# Altium schematic sheet CC-S02-V00-HighSideOutputs.SchDoc: High Side Outputs (BTS7080-2EPA)
size A3; DrawnBy: Jonn Dillon; DocumentNumber: 3; SheetNumber: 3; SheetTotal: 13; Project: Chassis Controller (Interim) 2020
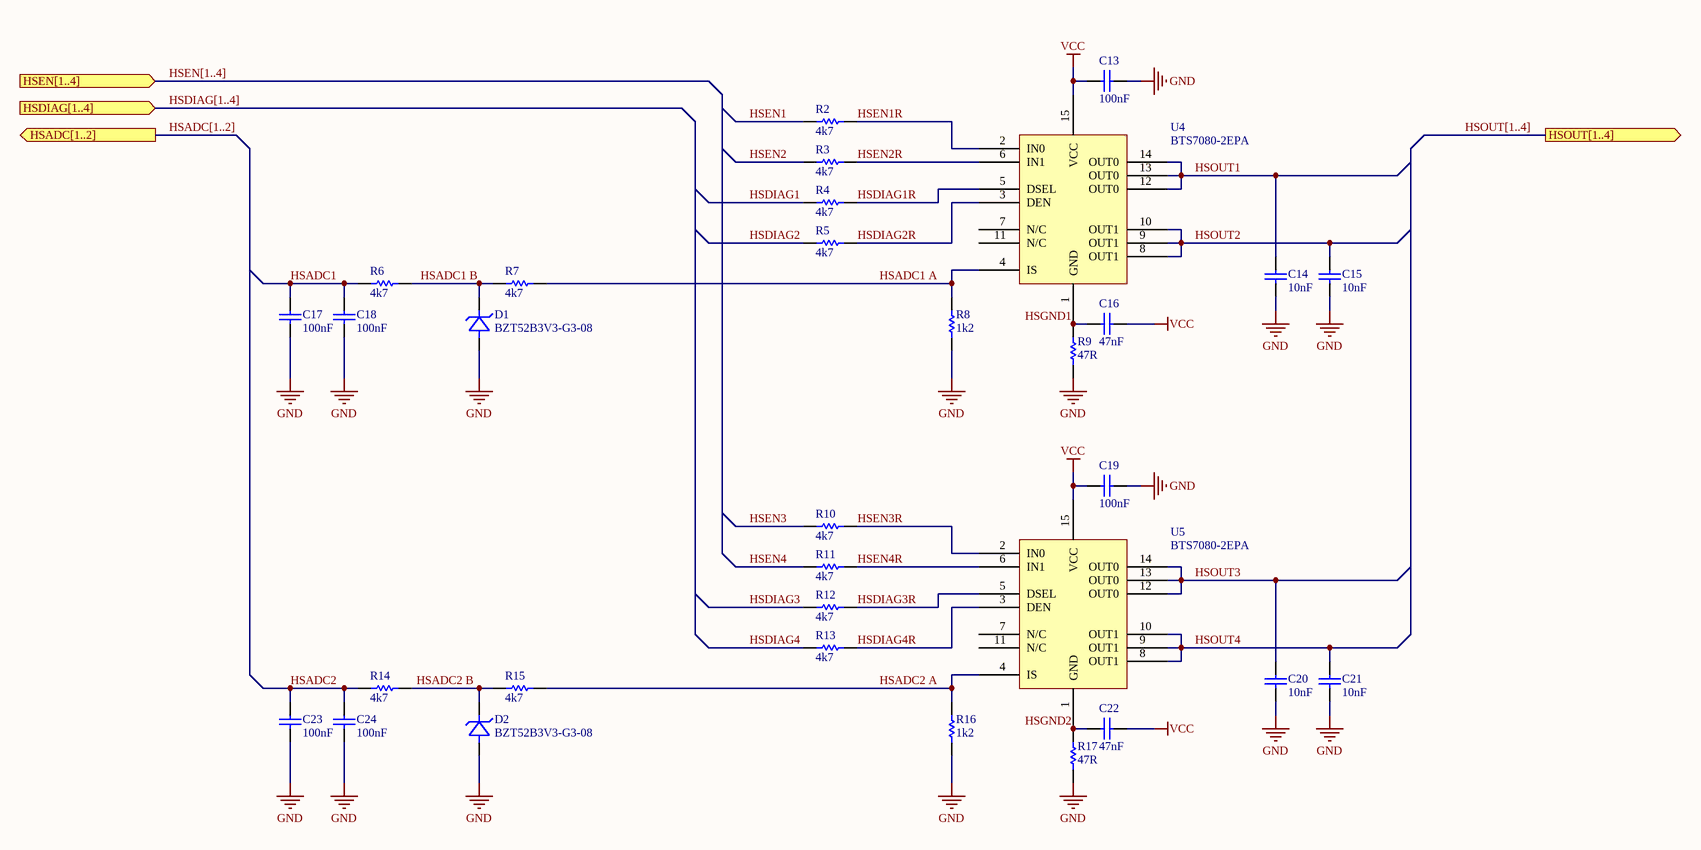
[diagram p0: CC-S02-V00-HighSideOutputs.SchDoc]

## Parts
C13  100nF  [Cap_Ceramic_0603]
C14  10nF  [Cap_Ceramic_0603]
C15  10nF  [Cap_Ceramic_0603]
C16  47nF  [Cap_Ceramic_0603]
C17  100nF  [Cap_Ceramic_0603]
C18  100nF  [Cap_Ceramic_0603]
C19  100nF  [Cap_Ceramic_0603]
C20  10nF  [Cap_Ceramic_0603]
C21  10nF  [Cap_Ceramic_0603]
C22  47nF  [Cap_Ceramic_0603]
C23  100nF  [Cap_Ceramic_0603]
C24  100nF  [Cap_Ceramic_0603]
D1  BZT52B3V3-G3-08  [SOD123]
D2  BZT52B3V3-G3-08  [SOD123]
R2  4k7  [Res_ThinFilm_0603]
R3  4k7  [Res_ThinFilm_0603]
R4  4k7  [Res_ThinFilm_0603]
R5  4k7  [Res_ThinFilm_0603]
R6  4k7  [Res_ThinFilm_0603]
R7  4k7  [Res_ThinFilm_0603]
R8  1k2  [Res_ThinFilm_0603]
R9  47R  [Res_ThinFilm_0603]
R10  4k7  [Res_ThinFilm_0603]
R11  4k7  [Res_ThinFilm_0603]
R12  4k7  [Res_ThinFilm_0603]
R13  4k7  [Res_ThinFilm_0603]
R14  4k7  [Res_ThinFilm_0603]
R15  4k7  [Res_ThinFilm_0603]
R16  1k2  [Res_ThinFilm_0603]
R17  47R  [Res_ThinFilm_0603]
U4  BTS7080-2EPA  [BTS70802EPA]
U5  BTS7080-2EPA  [BTS70802EPA]

## Ports
HSADC[1..2] (out), HSDIAG[1..4] (in), HSEN[1..4] (in), HSOUT[1..4] (out)

## Nets
GND: C13.2 C14.1 C15.1 C17.1 C18.1 C19.2 C20.1 C21.1 C23.1 C24.1 D1.A(Anode) D2.A(Anode) R8.2 R9.1 R16.2 R17.1
VCC: C13.1 C16.2 C19.1 C22.2 U4.15(VCC) U5.15(VCC)
HSADC1: C17.2 C18.2 R6.1
HSADC1 A: R7.2 R8.1 U4.4(IS)
HSADC1 B: D1.K(Cathode) R6.2 R7.1
HSADC2: C23.2 C24.2 R14.1
HSADC2 A: R15.2 R16.1 U5.4(IS)
HSADC2 B: D2.K(Cathode) R14.2 R15.1
HSDIAG1: R4.1
HSDIAG1R: R4.2 U4.5(DSEL)
HSDIAG2: R5.1
HSDIAG2R: R5.2 U4.3(DEN)
HSDIAG3: R12.1
HSDIAG3R: R12.2 U5.5(DSEL)
HSDIAG4: R13.1
HSDIAG4R: R13.2 U5.3(DEN)
HSEN1: R2.1
HSEN1R: R2.2 U4.2(IN0)
HSEN2: R3.1
HSEN2R: R3.2 U4.6(IN1)
HSEN3: R10.1
HSEN3R: R10.2 U5.2(IN0)
HSEN4: R11.1
HSEN4R: R11.2 U5.6(IN1)
HSGND1: C16.1 R9.2 U4.1(GND)
HSGND2: C22.1 R17.2 U5.1(GND)
HSOUT1: C14.2 U4.12(OUT0) U4.13(OUT0) U4.14(OUT0)
HSOUT2: C15.2 U4.8(OUT1) U4.9(OUT1) U4.10(OUT1)
HSOUT3: C20.2 U5.12(OUT0) U5.13(OUT0) U5.14(OUT0)
HSOUT4: C21.2 U5.8(OUT1) U5.9(OUT1) U5.10(OUT1)

Not connected (* = marked no-connect by the designer): U4 7(N/C) 11(N/C); U5 7(N/C) 11(N/C)

## Buses and harness runs
bus HSADC[1..2] = port HSADC[1..2]
bus HSDIAG[1..4] = port HSDIAG[1..4]
bus HSEN[1..4] = port HSEN[1..4]
bus HSOUT[1..4] = port HSOUT[1..4]

## Notes on the sheet
- Revision History:
- Sheet Title:
- Rev
- Date
- Description
- Project:
- Size:
- Drawn By:
- A3
- Number:
- Revision:
- Sheet
- Version:
- of
- QUT Motorsport
- O-120, Gardens Point
- 2 George Street
- Brisbane, QLD 4000
- Australia
- Print Date:
- Print Time:
- File Name:

## Library data of the parts
C13 C17-C19 C23 C24 = 100nF 50V 5% X7R 0603: Capacitor, Ceramic, SMD, 100nF, 50V, 5%, X7R, 0603
C14 C15 C20 C21 = 10nF 50V 5% X7R 0603: Capacitor, Ceramic, SMD, 10nF, 50V, 5%, X7R, 0603
C16 C22 = 47nF 50V 5% X7R 0603: Capacitor, Ceramic, SMD, 47nF, 50V, 5%, X7R, 0603
D1 D2 = BZT52B3V3-G3-08: Diode, SMD, Zenner, 3.3V, 2%, 410mW, SOD-123; ComponentLink1Description: Digikey; ComponentLink1URL: https://www.digikey.com.au/product-detail/en/vishay-semiconductor-diodes-division/BZT52B3V3-G3-08/BZT52B3V3-G3-08GICT-ND/8284035; ComponentLink2Description: Datasheet; ComponentLink2URL: https://www.vishay.com/docs/83340/bzt52g.pdf
R2-R7 R10-R15 = 4k7 5% 0603: Resistor, SMD, 4k7, 0.1W, 5%, 0603
R8 R16 = 1k2 5% 0603: Resistor, SMD, 1k2, 0.1W, 5%, 0603
R9 R17 = 47R 5% 0603: Resistor, SMD, 47R, 0.1W, 5%, 0603
U4 U5 = BTS7080-2EPA: Power Switch/Driver 1:1 N-Channel 3A PG-TSDSO-14-22; ComponentLink1Description: Digikey; ComponentLink1URL: https://www.digikey.com/product-detail/en/infineon-technologies/BTS70802EPAXUMA1/BTS70802EPAXUMA1CT-ND/8346497; ComponentLink2Description: Datasheet; ComponentLink2URL: https://www.infineon.com/dgdl/Infineon-BTS7080-2EPA-DataSheet-v01_06-EN.pdf?fileId=5546d4625e763904015e941bf21e2dbe